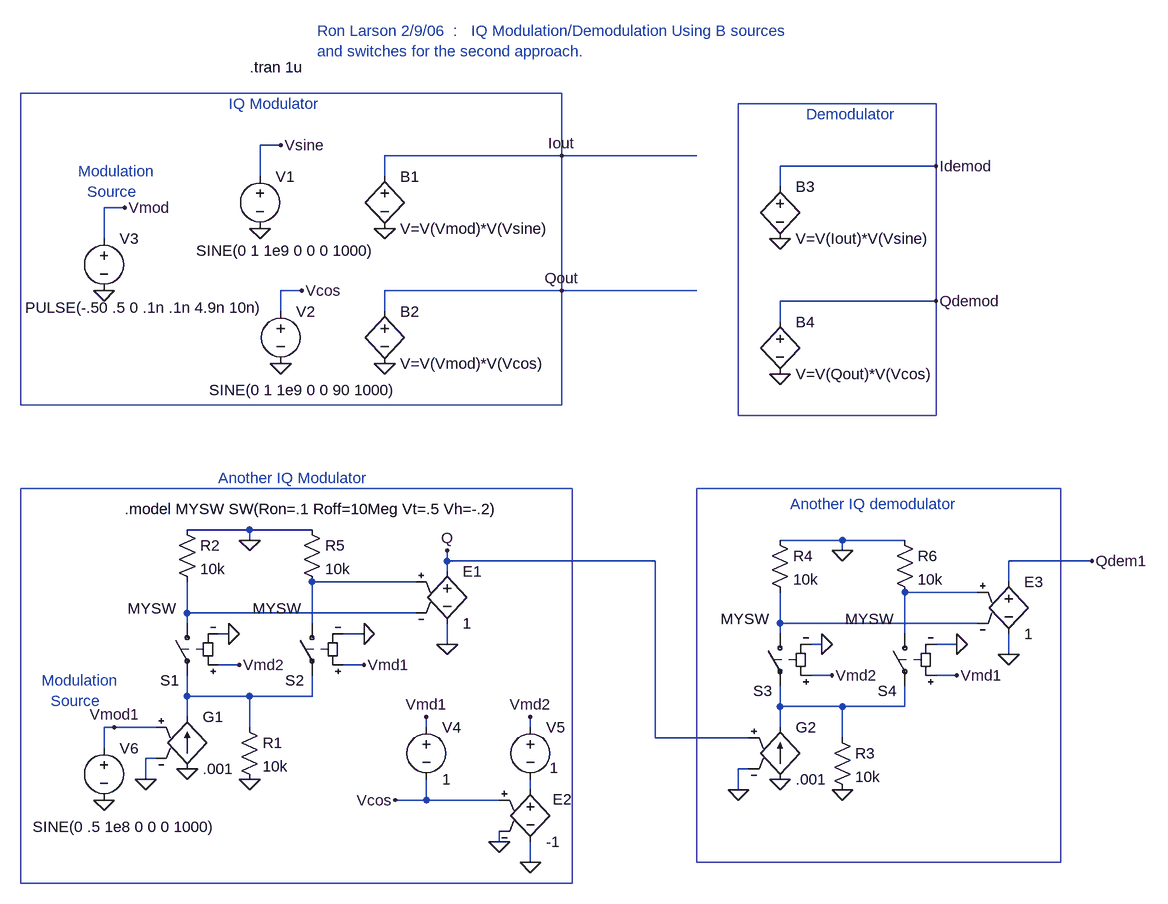
[diagram p0: schematic IQ_modulator.asc]
IQ_modulator.asc, the LTspice schematic file:
Version 4
SHEET 1 1356 1204
WIRE -272 208 -272 160
WIRE -272 992 -272 960
WIRE -256 960 -272 960
WIRE -240 160 -272 160
WIRE -208 1040 -208 1008
WIRE -192 960 -256 960
WIRE -192 1008 -208 1008
WIRE -144 784 -144 736
WIRE -144 800 -144 784
WIRE -144 912 -144 880
WIRE -144 944 -144 912
WIRE -80 816 -96 816
WIRE -64 864 -96 864
WIRE -48 656 -144 656
WIRE -48 672 -48 656
WIRE -48 912 -144 912
WIRE -48 960 -48 912
WIRE -32 112 -32 64
WIRE 0 64 -32 64
WIRE 0 320 0 288
WIRE 32 288 0 288
WIRE 48 656 -48 656
WIRE 48 800 48 736
WIRE 48 912 -48 912
WIRE 48 912 48 880
WIRE 128 816 96 816
WIRE 128 864 96 864
WIRE 160 112 160 80
WIRE 160 320 160 288
WIRE 208 736 48 736
WIRE 208 784 -144 784
WIRE 224 960 224 944
WIRE 224 1072 176 1072
WIRE 224 1072 224 1040
WIRE 256 704 256 688
WIRE 256 720 256 704
WIRE 256 832 256 800
WIRE 336 1072 224 1072
WIRE 336 1136 336 1120
WIRE 384 960 384 944
WIRE 384 1056 384 1040
WIRE 384 1168 384 1136
WIRE 432 80 160 80
WIRE 432 288 160 288
WIRE 576 704 256 704
WIRE 576 976 576 704
WIRE 640 80 432 80
WIRE 640 288 432 288
WIRE 704 1056 704 1024
WIRE 720 976 576 976
WIRE 720 1024 704 1024
WIRE 768 128 768 96
WIRE 768 336 768 304
WIRE 768 800 768 752
WIRE 768 816 768 800
WIRE 768 928 768 896
WIRE 768 960 768 928
WIRE 832 832 816 832
WIRE 848 880 816 880
WIRE 864 672 768 672
WIRE 864 688 864 672
WIRE 864 928 768 928
WIRE 864 976 864 928
WIRE 960 672 864 672
WIRE 960 816 960 752
WIRE 960 928 864 928
WIRE 960 928 960 896
WIRE 1008 96 768 96
WIRE 1008 304 768 304
WIRE 1040 832 1008 832
WIRE 1040 880 1008 880
WIRE 1072 752 960 752
WIRE 1072 800 768 800
WIRE 1120 736 1120 704
WIRE 1120 848 1120 816
WIRE 1248 704 1120 704
FLAG -32 192 0
FLAG 0 400 0
FLAG 160 192 0
FLAG -272 288 0
FLAG 432 80 Iout
FLAG 432 288 Qout
FLAG 0 64 Vsine
FLAG 32 288 Vcos
FLAG -240 160 Vmod
FLAG 160 400 0
FLAG 768 208 0
FLAG 1008 96 Idemod
FLAG 768 416 0
FLAG 1008 304 Qdemod
FLAG -144 1024 0
FLAG -208 1040 0
FLAG -48 1040 0
FLAG -48 672 0
FLAG -80 816 0
FLAG 256 688 Q
FLAG 128 816 0
FLAG 256 832 0
FLAG 128 864 Vmd1
FLAG -64 864 Vmd2
FLAG 224 944 Vmd1
FLAG 176 1072 Vcos
FLAG 384 944 Vmd2
FLAG 384 1168 0
FLAG 336 1136 0
FLAG -272 1072 0
FLAG -256 960 Vmod1
FLAG 768 1040 0
FLAG 704 1056 0
FLAG 864 1056 0
FLAG 864 688 0
FLAG 832 832 0
FLAG 1248 704 Qdem1
FLAG 1040 832 0
FLAG 1120 848 0
FLAG 1040 880 Vmd1
FLAG 848 880 Vmd2
SYMBOL voltage -32 96 R0
WINDOW 3 -98 130 Left 0
WINDOW 123 0 0 Left 0
WINDOW 39 0 0 Left 0
SYMATTR Value SINE(0 1 1e9 0 0 0 1000)
SYMATTR InstName V1
SYMBOL voltage 0 304 R0
WINDOW 3 -110 137 Left 0
WINDOW 123 0 0 Left 0
WINDOW 39 0 0 Left 0
SYMATTR Value SINE(0 1 1e9 0 0 90 1000)
SYMATTR InstName V2
SYMBOL bv 160 96 R0
SYMATTR InstName B1
SYMATTR Value V=V(Vmod)*V(Vsine)
SYMBOL voltage -272 192 R0
WINDOW 3 -121 122 Left 0
WINDOW 123 0 0 Left 0
WINDOW 39 0 0 Left 0
SYMATTR Value PULSE(-.50 .5 0 .1n .1n 4.9n 10n)
SYMATTR InstName V3
SYMBOL bv 160 304 R0
SYMATTR InstName B2
SYMATTR Value V=V(Vmod)*V(Vcos)
SYMBOL bv 768 112 R0
SYMATTR InstName B3
SYMATTR Value V=V(Iout)*V(Vsine)
SYMBOL bv 768 320 R0
SYMATTR InstName B4
SYMATTR Value V=V(Qout)*V(Vcos)
SYMBOL g -144 928 R0
SYMATTR InstName G1
SYMATTR Value .001
SYMBOL sw -144 784 M0
WINDOW 0 12 104 Left 0
WINDOW 3 17 -7 Left 0
SYMATTR InstName S1
SYMATTR Value MYSW
SYMBOL res -64 944 R0
SYMATTR InstName R1
SYMATTR Value 10k
SYMBOL res -160 640 R0
SYMATTR InstName R2
SYMATTR Value 10k
SYMBOL sw 48 784 M0
WINDOW 0 12 104 Left 0
WINDOW 3 17 -7 Left 0
SYMATTR InstName S2
SYMATTR Value MYSW
SYMBOL res 32 640 R0
SYMATTR InstName R5
SYMATTR Value 10k
SYMBOL e 256 704 R0
SYMATTR InstName E1
SYMATTR Value 1
SYMBOL voltage 224 944 R0
SYMATTR InstName V4
SYMATTR Value 1
SYMBOL voltage 384 944 R0
WINDOW 3 30 78 Left 0
SYMATTR InstName V5
SYMATTR Value 1
SYMBOL e 384 1040 R0
WINDOW 0 34 31 Left 0
SYMATTR InstName E2
SYMATTR Value -1
SYMBOL voltage -272 976 R0
WINDOW 3 -110 137 Left 0
WINDOW 123 0 0 Left 0
WINDOW 39 0 0 Left 0
SYMATTR Value SINE(0 .5 1e8 0 0 0 1000)
SYMATTR InstName V6
SYMBOL g 768 944 R0
SYMATTR InstName G2
SYMATTR Value .001
SYMBOL sw 768 800 M0
WINDOW 0 12 104 Left 0
WINDOW 3 17 -7 Left 0
SYMATTR InstName S3
SYMATTR Value MYSW
SYMBOL res 848 960 R0
SYMATTR InstName R3
SYMATTR Value 10k
SYMBOL res 752 656 R0
SYMATTR InstName R4
SYMATTR Value 10k
SYMBOL sw 960 800 M0
WINDOW 0 12 104 Left 0
WINDOW 3 17 -7 Left 0
SYMATTR InstName S4
SYMATTR Value MYSW
SYMBOL res 944 656 R0
SYMATTR InstName R6
SYMATTR Value 10k
SYMBOL e 1120 720 R0
SYMATTR InstName E3
SYMATTR Value 1
TEXT -48 -56 Left 0 !.tran 1u
TEXT -80 0 Left 0 ;IQ Modulator
TEXT -312 104 Left 0 ;Modulation\n  Source
TEXT 808 16 Left 0 ;Demodulator
TEXT -96 576 Left 0 ;Another IQ Modulator
TEXT -240 624 Left 0 !.model MYSW SW(Ron=.1 Roff=10Meg Vt=.5 Vh=-.2)
TEXT 784 616 Left 0 ;Another IQ demodulator
TEXT 56 -112 Left 0 ;Ron Larson 2/9/06  :   IQ Modulation/Demodulation Using B sources\nand switches for the second approach.
TEXT -368 888 Left 0 ;Modulation\n  Source
RECTANGLE Normal 432 -16 -400 464
RECTANGLE Normal 1008 0 704 480
RECTANGLE Normal -400 592 448 1200
RECTANGLE Normal 1200 592 640 1168

The netlist it stands for:
* IQ_modulator.asc
V1 Vsine 0 SINE(0 1 1e9 0 0 0 1000)
V2 Vcos 0 SINE(0 1 1e9 0 0 90 1000)
B1 Iout 0 V=V(Vmod)*V(Vsine)
V3 Vmod 0 PULSE(-.50 .5 0 .1n .1n 4.9n 10n)
B2 Qout 0 V=V(Vmod)*V(Vcos)
B3 Idemod 0 V=V(Iout)*V(Vsine)
B4 Qdemod 0 V=V(Qout)*V(Vcos)
G1 0 N002 Vmod1 0 .001
S1 N001 N002 Vmd2 0 MYSW
R1 N002 0 10k
R2 0 N001 10k
S2 N003 N002 Vmd1 0 MYSW
R5 0 N003 10k
E1 Q 0 N003 N001 1
V4 Vmd1 Vcos 1
V5 Vmd2 N004 1
E2 N004 0 Vcos 0 -1
V6 Vmod1 0 SINE(0 .5 1e8 0 0 0 1000)
G2 0 N006 Q 0 .001
S3 N005 N006 Vmd2 0 MYSW
R3 N006 0 10k
R4 0 N005 10k
S4 N007 N006 Vmd1 0 MYSW
R6 0 N007 10k
E3 Qdem1 0 N007 N005 1
.tran 1u
* IQ Modulator
* Modulation
*   Source
* Demodulator
* Another IQ Modulator
.model MYSW SW(Ron=.1 Roff=10Meg Vt=.5 Vh=-.2)
* Another IQ demodulator
* Ron Larson 2/9/06  :   IQ Modulation/Demodulation Using B sources
* and switches for the second approach.
* Modulation
*   Source
.backanno
.end